# Altium schematic sheet PSD_PMIC.SchDoc
size A4; SheetNumber: 1; SheetTotal: 2
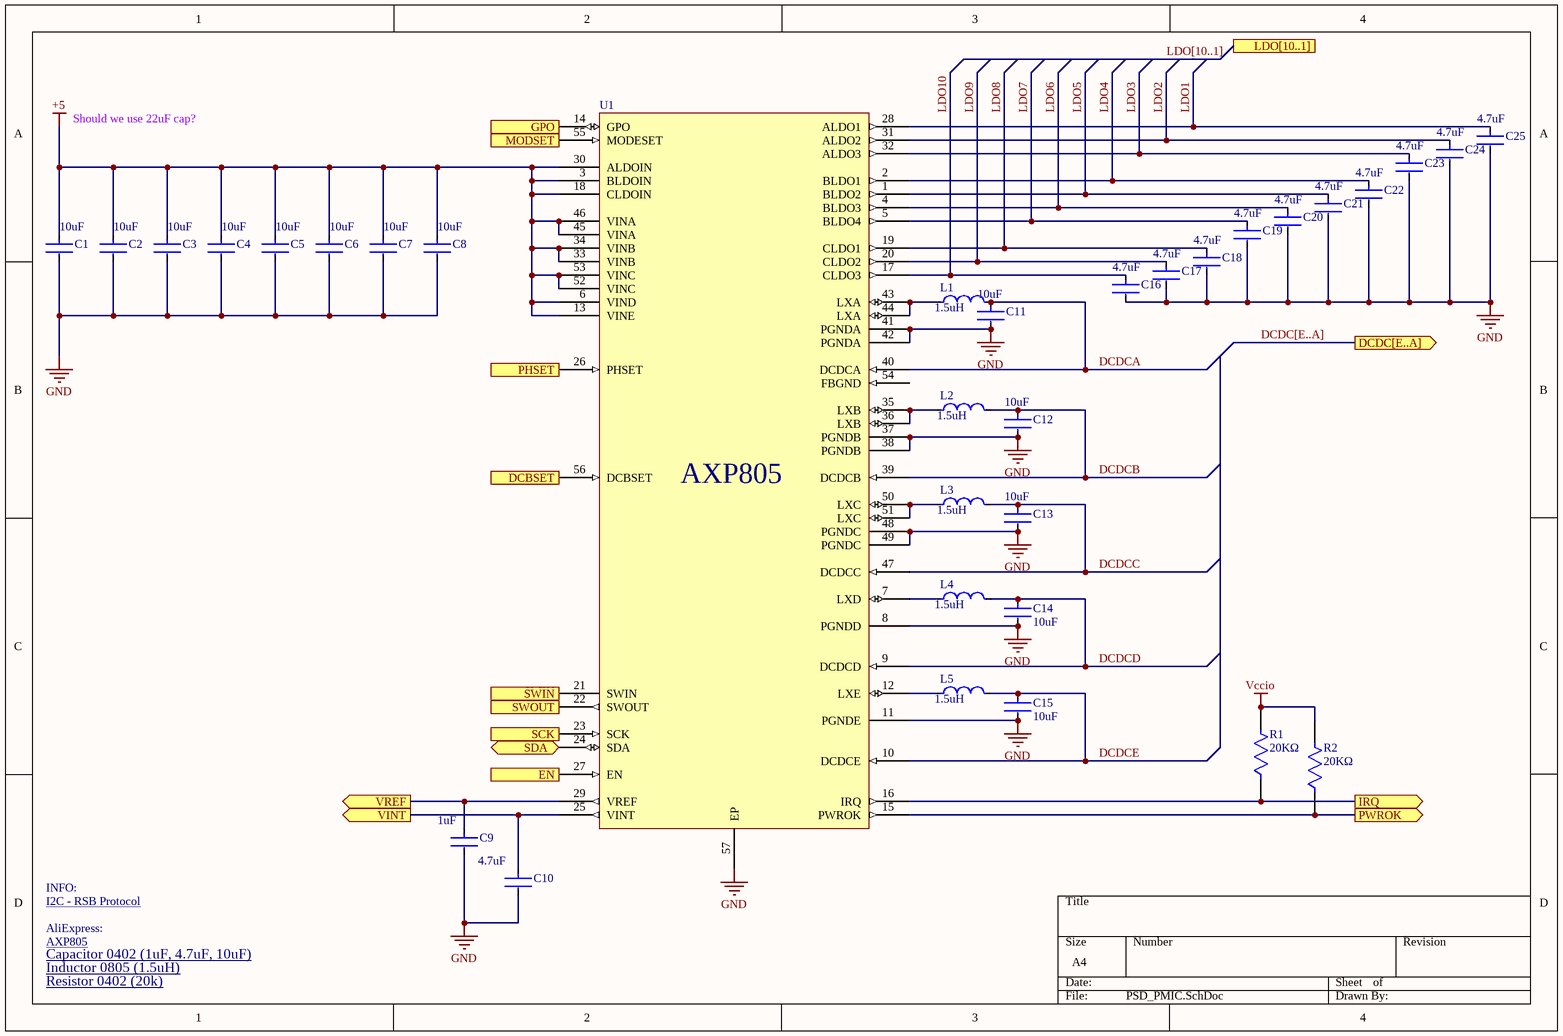
[diagram p0: PSD_PMIC.SchDoc]

## Parts
C1  Capacitance: 10uF  [FP-CL05A106MP5NUNC-MFG]  (hidden comment: CL05A106MP5NUNC)
C2  Capacitance: 10uF  [FP-CL05A106MP5NUNC-MFG]  (hidden comment: CL05A106MP5NUNC)
C3  Capacitance: 10uF  [FP-CL05A106MP5NUNC-MFG]  (hidden comment: CL05A106MP5NUNC)
C4  Capacitance: 10uF  [FP-CL05A106MP5NUNC-MFG]  (hidden comment: CL05A106MP5NUNC)
C5  Capacitance: 10uF  [FP-CL05A106MP5NUNC-MFG]  (hidden comment: CL05A106MP5NUNC)
C6  Capacitance: 10uF  [FP-CL05A106MP5NUNC-MFG]  (hidden comment: CL05A106MP5NUNC)
C7  Capacitance: 10uF  [FP-CL05A106MP5NUNC-MFG]  (hidden comment: CL05A106MP5NUNC)
C8  Capacitance: 10uF  [FP-CL05A106MP5NUNC-MFG]  (hidden comment: CL05A106MP5NUNC)
C9  Capacitance: 1uF  [FP-CL95-IPC_C]  (hidden comment: CL05B105KQ5NQNC)
C10  Capacitance: 4.7uF  [FP-CL828-IPC_C]  (hidden comment: CL05A475KP5NRNC)
C11  Capacitance: 10uF  [FP-CL05A106MP5NUNC-MFG]  (hidden comment: CL05A106MP5NUNC)
C12  Capacitance: 10uF  [FP-CL05A106MP5NUNC-MFG]  (hidden comment: CL05A106MP5NUNC)
C13  Capacitance: 10uF  [FP-CL05A106MP5NUNC-MFG]  (hidden comment: CL05A106MP5NUNC)
C14  Capacitance: 10uF  [FP-CL05A106MP5NUNC-MFG]  (hidden comment: CL05A106MP5NUNC)
C15  Capacitance: 10uF  [FP-CL05A106MP5NUNC-MFG]  (hidden comment: CL05A106MP5NUNC)
C16  Capacitance: 4.7uF  [FP-CL828-IPC_C]  (hidden comment: CL05A475KP5NRNC)
C17  Capacitance: 4.7uF  [FP-CL828-IPC_C]  (hidden comment: CL05A475KP5NRNC)
C18  Capacitance: 4.7uF  [FP-CL828-IPC_C]  (hidden comment: CL05A475KP5NRNC)
C19  Capacitance: 4.7uF  [FP-CL828-IPC_C]  (hidden comment: CL05A475KP5NRNC)
C20  Capacitance: 4.7uF  [FP-CL828-IPC_C]  (hidden comment: CL05A475KP5NRNC)
C21  Capacitance: 4.7uF  [FP-CL828-IPC_C]  (hidden comment: CL05A475KP5NRNC)
C22  Capacitance: 4.7uF  [FP-CL828-IPC_C]  (hidden comment: CL05A475KP5NRNC)
C23  Capacitance: 4.7uF  [FP-CL828-IPC_C]  (hidden comment: CL05A475KP5NRNC)
C24  Capacitance: 4.7uF  [FP-CL828-IPC_C]  (hidden comment: CL05A475KP5NRNC)
C25  Capacitance: 4.7uF  [FP-CL828-IPC_C]  (hidden comment: CL05A475KP5NRNC)
L1  Inductance: 1.5uH  [FP-LQM21DN_00-MFG]  (hidden comment: LQM21NN1R5K10D)
L2  Inductance: 1.5uH  [FP-LQM21DN_00-MFG]  (hidden comment: LQM21NN1R5K10D)
L3  Inductance: 1.5uH  [FP-LQM21DN_00-MFG]  (hidden comment: LQM21NN1R5K10D)
L4  Inductance: 1.5uH  [FP-LQM21DN_00-MFG]  (hidden comment: LQM21NN1R5K10D)
L5  Inductance: 1.5uH  [FP-LQM21DN_00-MFG]  (hidden comment: LQM21NN1R5K10D)
R1  value 20KΩ  [FP-RT0402-MFG]  (hidden comment: RT0402BRD0720KL)
R2  value 20KΩ  [FP-RT0402-MFG]  (hidden comment: RT0402BRD0720KL)
U1  UQFN127P600-8N  [UQFN127P600-8N]  (value not drawn)

## Ports
DCBSET (out), DCDC[E..A] (out), EN (out), GPO (out), IRQ (out), LDO[10..1], MODSET (out), PHSET (out), PWROK (out), SCK (in), SDA (bidir), SWIN (out), SWOUT (out), VINT (out), VREF (out)

## Nets
+5: C1.1 C2.1 C3.1 C4.1 C5.1 C6.1 C7.1 C8.1 U1.3(BLDOIN) U1.6(VIND) U1.13(VINE) U1.18(CLDOIN) U1.30(ALDOIN) U1.33(VINB) U1.34(VINB) U1.45(VINA) U1.46(VINA) U1.52(VINC) U1.53(VINC)
GND: C1.2 C2.2 C3.2 C4.2 C5.2 C6.2 C7.2 C8.2 C9.2 C10.2 C11.2 C12.2 C13.2 C14.2 C15.2 C16.2 C17.2 C18.2 C19.2 C20.2 C21.2 C22.2 C23.2 C24.2 C25.2 U1.8(PGNDD) U1.11(PGNDE) U1.37(PGNDB) U1.38(PGNDB) U1.41(PGNDA) U1.42(PGNDA) U1.48(PGNDC) U1.49(PGNDC) U1.57(EP)
Vccio: R1.2 R2.2
DCBSET: U1.56(DCBSET) ; port DCBSET
DCDCA: C11.1 L1.2 U1.40(DCDCA)
DCDCB: C12.1 L2.2 U1.39(DCDCB)
DCDCC: C13.1 L3.2 U1.47(DCDCC)
DCDCD: C14.1 L4.2 U1.9(DCDCD)
DCDCE: C15.1 L5.2 U1.10(DCDCE)
EN: U1.27(EN) ; port EN
GPO: U1.14(GPO) ; port GPO
IRQ: R1.1 U1.16(IRQ) ; port IRQ
LDO1: C25.1 U1.28(ALDO1)
LDO2: C24.1 U1.31(ALDO2)
LDO3: C23.1 U1.32(ALDO3)
LDO4: C22.1 U1.2(BLDO1)
LDO5: C21.1 U1.1(BLDO2)
LDO6: C20.1 U1.4(BLDO3)
LDO7: C19.1 U1.5(BLDO4)
LDO8: C18.1 U1.19(CLDO1)
LDO9: C17.1 U1.20(CLDO2)
LDO10: C16.1 U1.17(CLDO3)
MODSET: U1.55(MODESET) ; port MODSET
PHSET: U1.26(PHSET) ; port PHSET
PWROK: R2.1 U1.15(PWROK) ; port PWROK
SCK: U1.23(SCK) ; port SCK
SDA: U1.24(SDA) ; port SDA
SWIN: U1.21(SWIN) ; port SWIN
SWOUT: U1.22(SWOUT) ; port SWOUT
VINT: C10.1 U1.25(VINT) ; port VINT
VREF: C9.1 U1.29(VREF) ; port VREF
NetL1_1: L1.1 U1.43(LXA) U1.44(LXA)
NetL2_1: L2.1 U1.35(LXB) U1.36(LXB)
NetL3_1: L3.1 U1.50(LXC) U1.51(LXC)
NetL4_1: L4.1 U1.7(LXD)
NetL5_1: L5.1 U1.12(LXE)

Not connected (* = marked no-connect by the designer): U1 54(FBGND)

## Buses and harness runs
bus DCDC[E..A] = port DCDC[E..A]
bus LDO[10..1] = port LDO[10..1]

## Notes on the sheet
- Should we use 22uF cap?
- I2C - RSB Protocol <https://linux-sunxi.org/Reduced_Serial_Bus>
- INFO:
- Capacitor 0402 (1uF, 4.7uF, 10uF) <https://aliexpress.ru/item/1005001948033366.html?sku_id=12000022992959542>
- Inductor 0805 (1.5uH) <https://aliexpress.ru/item/10000019721146.html?sku_id=20000000029337167&>
- Resistor 0402 (20k) <https://aliexpress.ru/item/32864744837.html?sku_id=65451101994>
- AXP805 <https://aliexpress.ru/item/1005007559660422.html>
- AliExpress:
- (in symbol UQFN127P600-8N) AXP805

## Library data of the parts
C1-C8 C11-C15 = CMP-13271-000002-1: CAP CER 10UF 10V X5R 0402; Manufacturer: Samsung; Temperature Coefficient: 15%; Tolerance: 20%; Material: Ceramic; Octopart: https://octopart.com/cl05a106mp5nunc-samsung-22457395; Voltage Rating: 10V; RoHS: TRUE; Value: 10uF; Height: 0.7mm; Digikey Description: CAP CER 10UF 10V X5R 0402; Automotive: No; Package: CL05A106MP5NUNC; Device Class L1: Passive Components; Temperature Range High: +85°C; ComponentLink2Description: Datasheet; Device Class L2: Capacitors; Temperature Characteristic: X5R; Manufacturer Part Number: CL05A106MP5NUNC; Temperature: -55°C to +85°C; ComponentLink2URL: http://www.samsungsem.com/kr/support/product-search/mlcc/__icsFiles/afieldfile/2019/05/10/19-CL05A106MP5NUNC.pdf; Device Class L3: Ceramic Capacitors; Category: Cap; Temperature Range Low: -55°C; Ipc Land Pattern Name: CAPC10050X50; Lead Free: Yes
C9 = CMP-13271-000020-2: Cap Ceramic 1uF 6.3V X7R ±10% SMD 0402 +125°C Paper T/R; Termination: Wraparound; Depth: 0.5mm; Lead Free: Lead Free; Width: 0.02inch; Min Operating Temperature: -55°C; Voltage Rating: 6.3V; Packaging: Tape and Reel; Mount: Surface Mount; Case Code (Metric): 1005; Contact Plating: Tin; Tolerance: 10%; Thickness: 0.022inch; Package Quantity: 1; Dielectric: X7R; Case Code (Imperial): 0402; Length: 1mm; Case/Package: 0402; Max Operating Temperature: 125°C
C10 C16-C25 = CMP-13271-001251-1: Cap Ceramic 4.7uF 10V X5R ±10% SMD 0402 +85°C Paper T/R; Height: 0.5mm; Mount: Surface Mount; Case Code (Metric): 1005; Case/Package: 0402; Packaging: Tape and Reel; Dielectric: X5R; Radiation Hardening: No; Material: Ceramic; Thickness: 0.022inch; Min Operating Temperature: -55°C; Voltage Rating: 10V; Case Code (Imperial): 0402; Width: 0.02inch; Length: 1mm; Max Operating Temperature: 85°C; Lead Free: Lead Free; Tolerance: 10%; Package Quantity: 1; Depth: 0.5mm
L1-L5 = CMP-06042-016990-1: Multilayer Type Inductor for General Circuits, 0805 (2012), 1.5μH, 10%, 0.5Ω, 50mA; Core Material: Ferrite; Shielding: Shielded; DC Resistance (DCR): 500mR; Test Frequency: 10MHz; Self Resonant Frequency: 87MHz; Q Factor: 45; Rated Current-Max: 50mA; Tolerance: 10%; Max DC Current: 50mA; Lead Free: Lead Free; Height: 0.85mm; REACH SVHC: No SVHC; Packaging: Tape and Reel; Width: 0.049inch; Package Quantity: 4000; Case Code (Imperial): 0805; Max Operating Temperature: 85°C; Mount: Surface Mount; Case Code (Metric): 2012; Radiation Hardening: No; Military Standard: Not; Inductance Tolerance: 10%; Case/Package: 0805; Current Rating: 50mA; Depth: 1.45mm; Series: LQM21N; Height - Seated (Max): 0.041inch; Length: 2mm; Termination: SMD/SMT; RoHS Compliant: Yes; DC Current: 50mA; Min Operating Temperature: -40°C
R1 R2 = CMP-2002-02936-2: RES SMD 20K OHM 0.1% 1/16W 0402; Manufacturer: Yageo; Power Rating: 0.063W; Tolerance: 0.001; Voltage Rating: 50V; Temperature Coefficient: 25 ppm/°C; ComponentLink2Description: Datasheet; Footprint Url: http://www.yageo.com/exep/pages/download/literatures/PYu-R_Mount_10.pdf; Automotive: No; Manufacturer Part Number: RT0402BRD0720KL; Temperature Range Low: -55°C; Octopart: https://octopart.com/rt0402brd0720kl-yageo-1422805; Digikey Description: RES SMD 20K OHM 0.1% 1/16W 0402; Device Class L3: Chip SMD Resistors; Series: RT; Composition: Thin Film; Temperature: -55°C to +155°C; Lead Free: Yes; Height: 0.35mm; Package: RT0402; Mouser Description: Res Thin Film 0402 20K Ohm 0.1% 1/16W ±25ppm/°C Molded SMD SMD Paper T/R; Ipc Land Pattern Name: RESC10050X30; RoHS: TRUE; Device Class L1: Passive Components; Category: Res; Temperature Range High: +155°C; Device Class L2: Resistors; ComponentLink2URL: http://www.yageo.com/documents/recent/PYu-RT_1-to-0.01_RoHS_L_9.pdf; Resistance: 20KΩ